# EAGLE design PCB_Team12 (EAGLE 7.5.0)
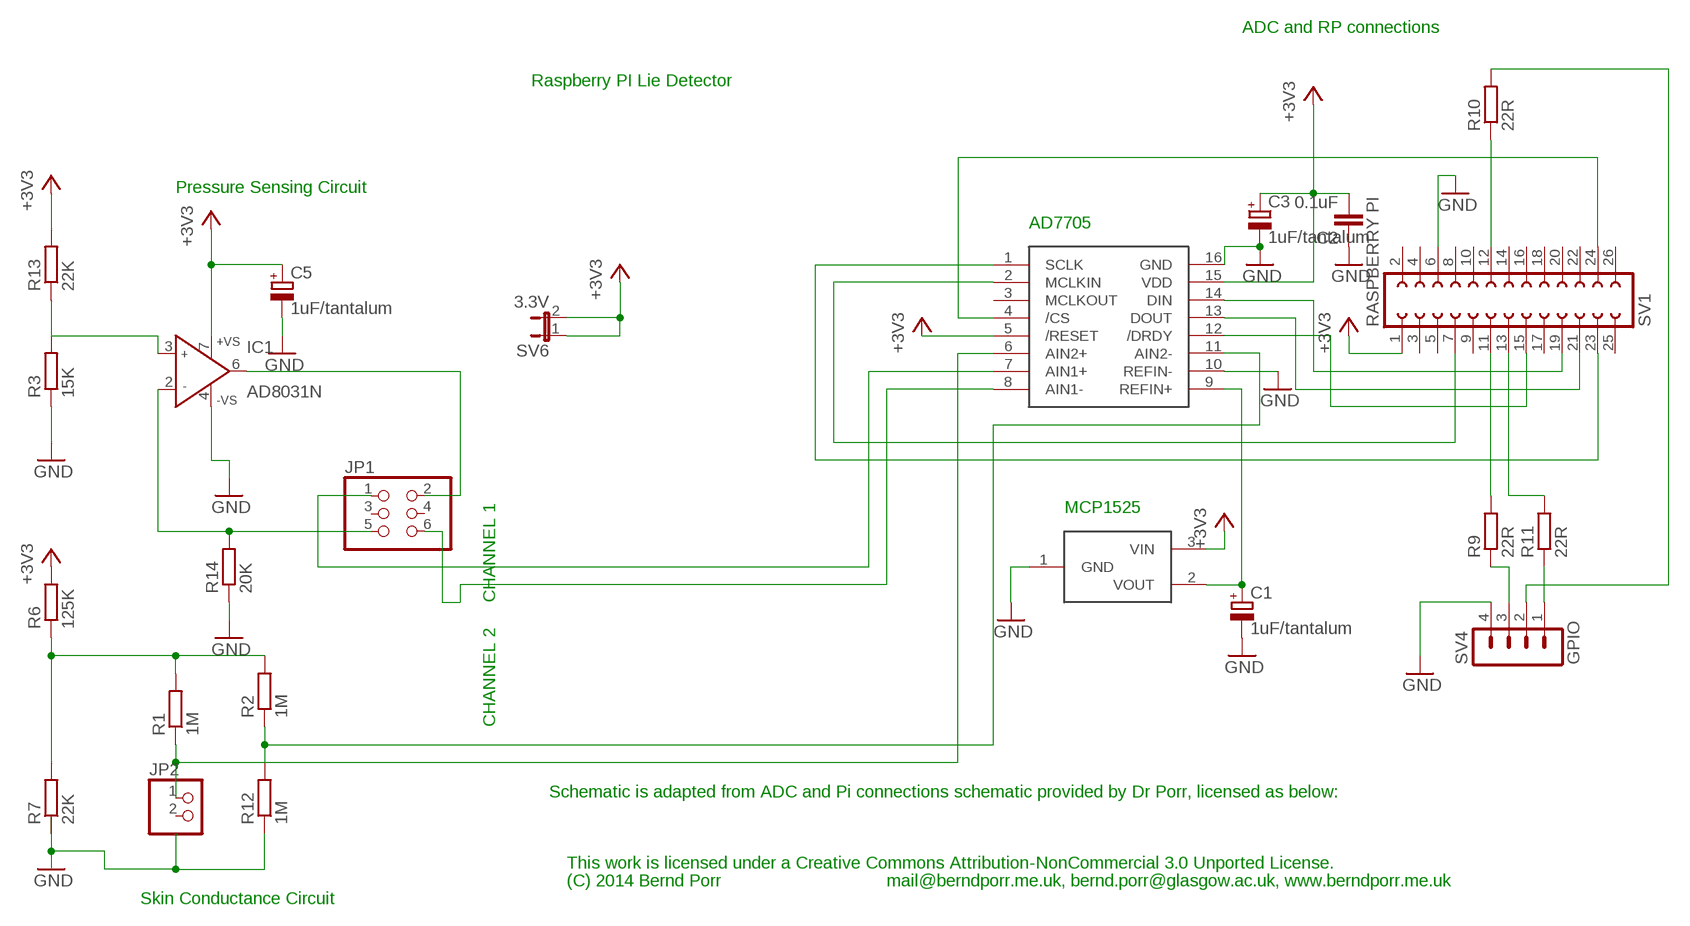
[diagram p0: schematic, sheet 1]

## Parts
C1  1uF/tantalum  CPOL-EUTT2D7  [TT2D7]
C2  0.1uF  C5/2.5  [C5B2.5]
C3  1uF/tantalum  CPOL-EUTT2D7  [TT2D7]
C5  1uF/tantalum  CPOL-EUTT2D7  [TT2D7]
IC1  AD8031N  [DIL08]
JP1  PINHD-2X3  [2X03]
JP2  PINHD-1X2  [1X02]
R1  1M  R-EU_0207/10  [0207/10]
R2  1M  R-EU_0207/10  [0207/10]
R3  15K  R-EU_0207/10  [0207/10]
R6  125K  R-EU_0207/10  [0207/10]
R7  22K  R-EU_0207/10  [0207/10]
R9  22R  R-EU_0207/10  [0207/10]
R10  22R  R-EU_0207/10  [0207/10]
R11  22R  R-EU_0207/10  [0207/10]
R12  1M  R-EU_0207/10  [0207/10]
R13  22K  R-EU_0207/10  [0207/10]
R14  20K  R-EU_0207/10  [0207/10]
SV1  RASPBERRY PI  FE13-2  [FE13-2]
SV4  GPIO  MA04-1  [MA04-1]
SV6  3.3V  JP1E  [JP1]
U$1  AD7705  [DIP16]
U$2  MCP1525  [TO92]

## Nets
+3V3: C2.2 C3.+ C5.+ IC1.7(+VS) R6.2 R13.2 SV1.1 SV6.1 SV6.2 U$1.5(/RESET) U$1.15(VDD) U$2.3(VIN)
GND: C1.- C2.1 C3.- C5.- IC1.4(-VS) R3.1 R14.1 SV1.6 SV4.4 U$1.10(REFIN-) U$1.16(GND) U$2.1(GND)
N$1: SV1.19 U$1.14(DIN)
N$2: SV1.23 U$1.1(SCLK)
N$3: SV1.7 U$1.2(MCLKIN)
N$4: SV1.24 U$1.4(/CS)
N$5: C1.+ U$1.9(REFIN+) U$2.2(VOUT)
N$6: SV1.21 U$1.13(DOUT)
N$7: IC1.2(IN-) JP1.5 R14.2
N$8: JP1.1 U$1.7(AIN1+)
N$11: R1.2 R2.2 R6.1 R7.2
N$15: R9.2 SV1.11
N$16: R10.1 SV1.12
N$17: R11.2 SV1.13
N$18: R9.1 SV4.3
N$19: R11.1 SV4.1
N$20: R10.2 SV4.2
N$21: SV1.15 U$1.12(/DRDY)
N$23: IC1.3(IN+) R3.2 R13.1
N$24: R2.1 R12.2 U$1.11(AIN2-)
N$26: IC1.6(OUT) JP1.2
N$29: JP1.6 U$1.8(AIN1-)
N$30: JP2.1 R1.1 U$1.6(AIN2+)
N$31: R12.1
Unconnected: JP1.3 JP1.4 JP2.2 R7.1 SV1.2 SV1.3 SV1.4 SV1.5 SV1.8 SV1.9 SV1.10 SV1.14 SV1.16 SV1.17 SV1.18 SV1.20 SV1.22 SV1.25 SV1.26 U$1.3(MCLKOUT)

## Notes on the sheet
- ADC and RP connections
- Raspberry PI Lie Detector
- Pressure Sensing Circuit
- AD7705
- MCP1525
- CHANNEL 1
- CHANNEL 2
- Schematic is adapted from ADC and Pi connections schematic provided by Dr Porr, licensed as below:
- This work is licensed under a Creative Commons Attribution-NonCommercial 3.0 Unported License.
- (C) 2014 Bernd Porr | mail@berndporr.me.uk, bernd.porr@glasgow.ac.uk, www.berndporr.me.uk
- Skin Conductance Circuit

## Library data of the parts
C1 C3 C5 = rcl:CPOL-EU: POLARIZED CAPACITOR, European symbol
C2 = capacitor-wima:C: CAPACITOR naming: grid - package width
IC1 = analog-devices:AD8031: 2.7 V, 800 ?A, 80 MHz Rail-to-Rail I/O Amplifiers Source: http://www.analog.com/static/imported-files/data_sheets/AD8031_8032.pdf; MPN: AD8031BNZ; OC_FARNELL: 1438575; OC_NEWARK: 15P0920
JP1 = pinhead:PINHD-2X3: PIN HEADER
JP2 = pinhead:PINHD-1X2: PIN HEADER
R1-R3 R6 R7 R9-R14 = resistor:R-EU_: RESISTOR, European symbol
SV1 = con-lsta:FE13-2: FEMALE HEADER; OC_FARNELL: unknown; OC_NEWARK: unknown
SV4 = con-lstb:MA04-1: PIN HEADER; OC_FARNELL: unknown; OC_NEWARK: unknown
SV6 = jumper:JP1E: JUMPER
U$1 = rpi:AD7705
U$2 = rpi:MCP1525

## Board
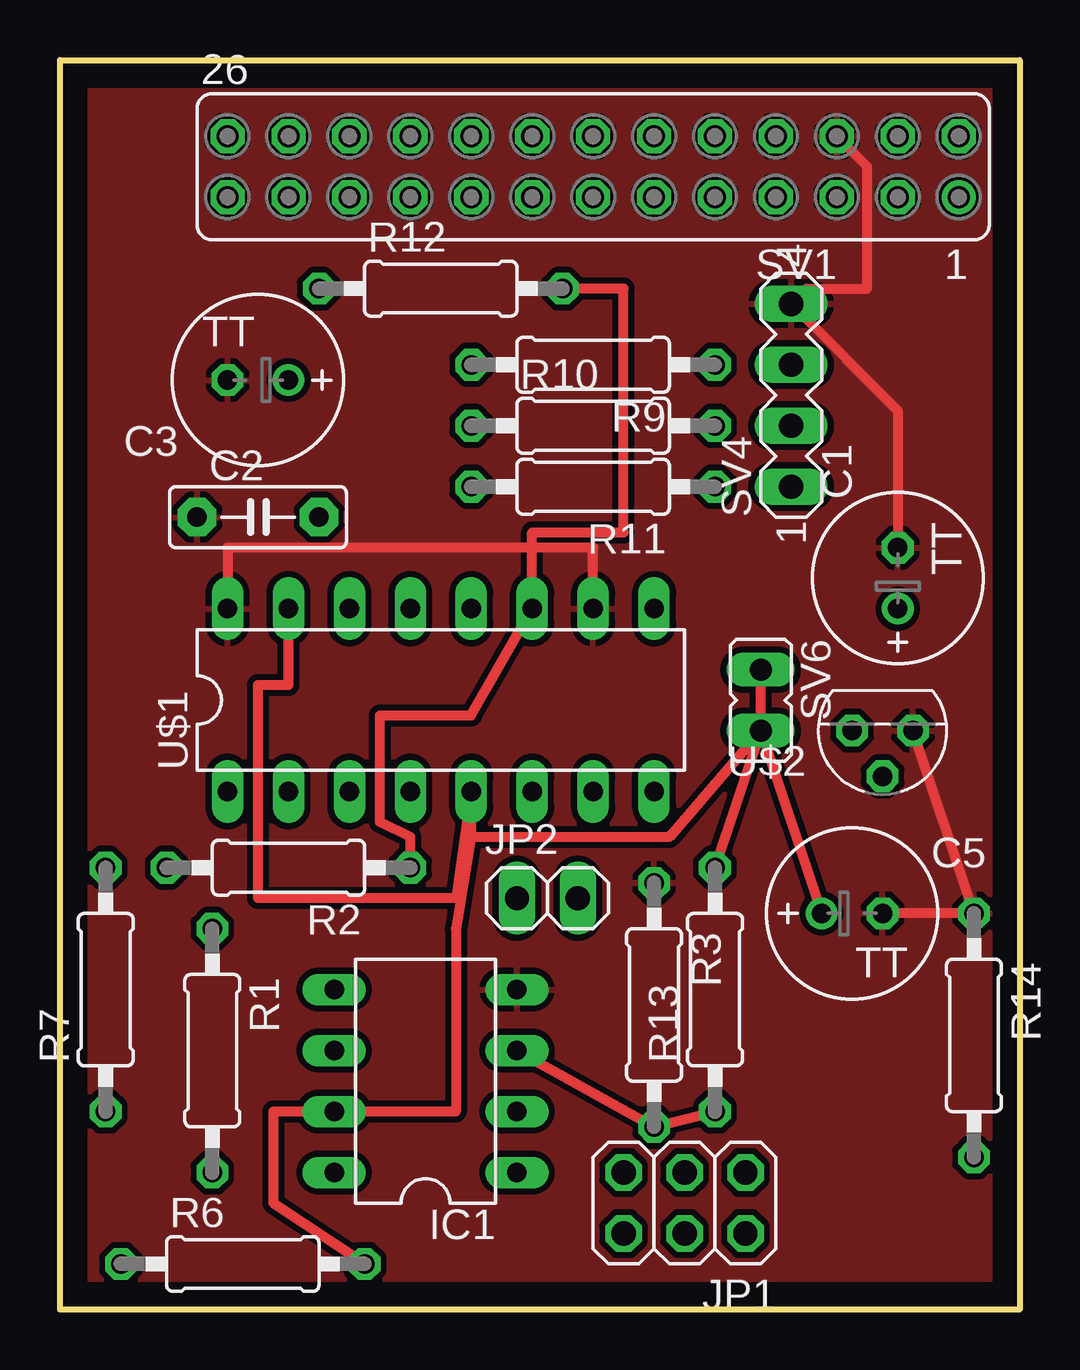
[diagram p1: board, top side]
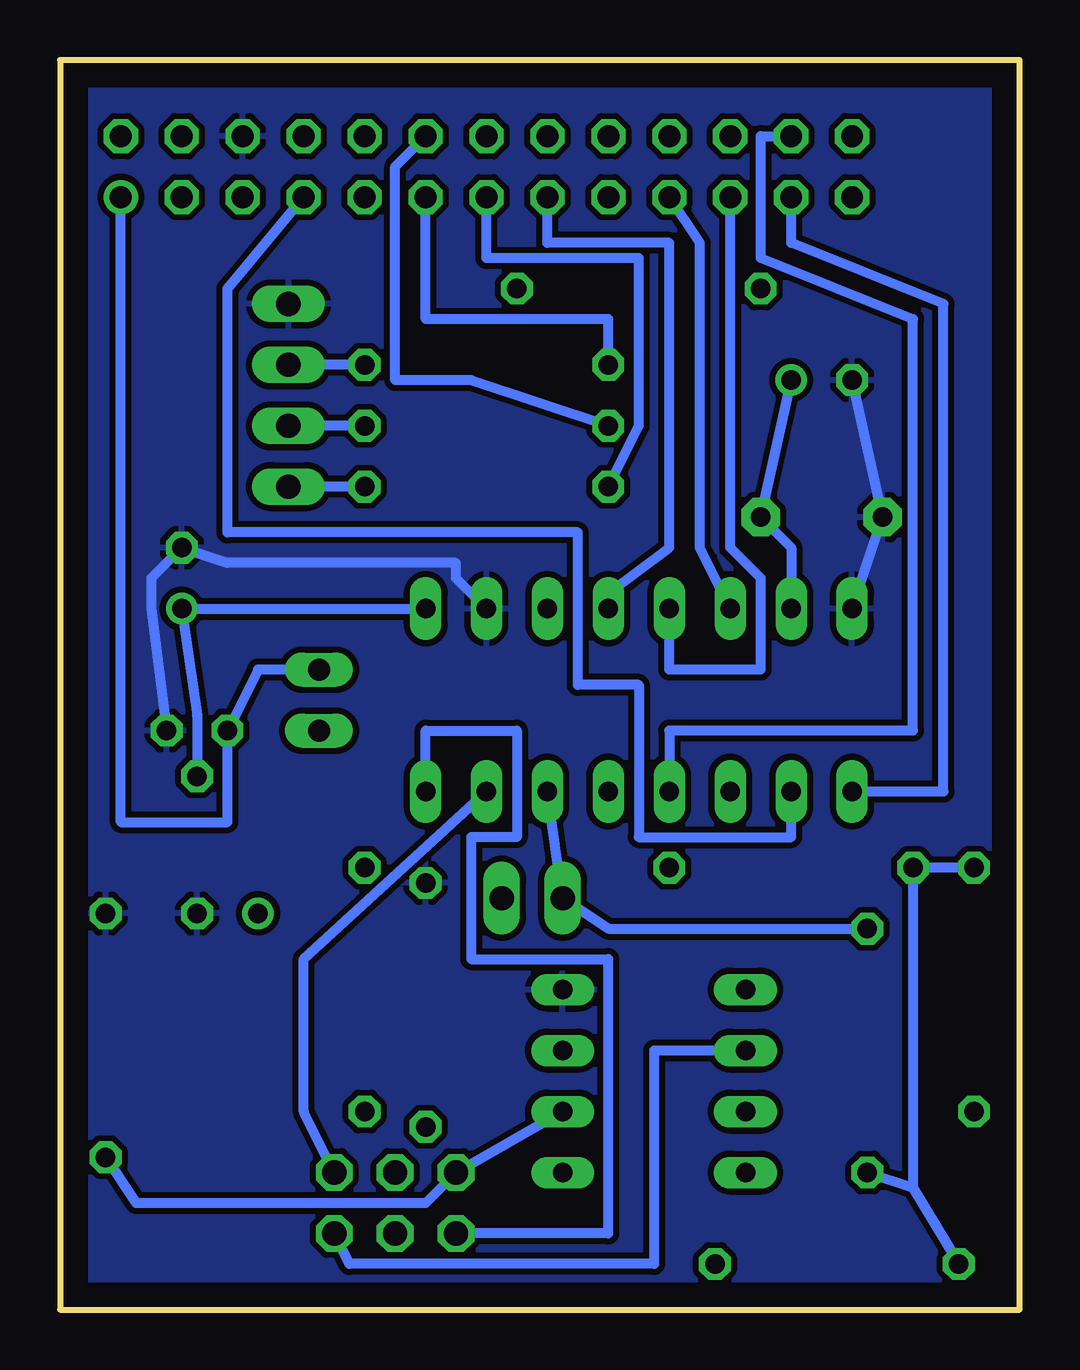
[diagram p2: board, bottom side, seen from below]

Size 40.01 x 52.07 mm. Coordinates in mm from the lower left corner, seen from the top.
Outline: 0,0 0,52.07 40.01,52.07 40.01,0 0,0
Copper layers (1*16): Top 0.035mm / dielectric 1.5mm / Bottom 0.035mm
Design rules "default": minimum track width 10mil, minimum drill 24mil, track to track 8mil, track to pad 8mil, pad to pad 8mil, via to via 8mil, smd to smd 8mil, copper to edge 40mil, drill to drill 8mil, minimum pad ring 10mil, minimum via ring 8mil, stop-mask expansion 4mil, vias tented up to drill 0mil, thermal gap 10mil

### Footprints (pad centres in the part's own frame; a part is rotated, then mirrored left to right if it is on the bottom)
TT2D7 = drill 0.813: + -1.27,0 | drill 0.813 octagon: - 1.27,0
C5B2.5 = drill 0.813 pad 1.6 octagon: 1 -2.54,0; 2 2.54,0
DIL08 = drill 0.813 long: 1 -3.81,-3.81; 2 -1.27,-3.81; 3 1.27,-3.81; 4 3.81,-3.81; 5 3.81,3.81; 6 1.27,3.81; 7 -1.27,3.81; 8 -3.81,3.81
2X03 = drill 1.016 octagon: 1 -2.54,-1.27; 2 -2.54,1.27; 3 0,-1.27; 4 0,1.27; 5 2.54,-1.27; 6 2.54,1.27
1X02 = drill 1.016 long: 1 -1.27,0; 2 1.27,0
0207/10 = drill 0.813 octagon: 1 -5.08,0; 2 5.08,0
FE13-2 = drill 0.914: 1 -15.24,1.27 | drill 0.914 octagon: 2 -15.24,-1.27; 3 -12.7,1.27; 4 -12.7,-1.27; 5 -10.16,1.27; 6 -10.16,-1.27; 7 -7.62,1.27; 8 -7.62,-1.27; 9 -5.08,1.27; 10 -5.08,-1.27; 11 -2.54,1.27; 12 -2.54,-1.27; 13 0,1.27; 14 0,-1.27; 15 2.54,1.27; 16 2.54,-1.27; 17 5.08,1.27; 18 5.08,-1.27; 19 7.62,1.27; 20 7.62,-1.27; 21 10.16,1.27; 22 10.16,-1.27; 23 12.7,1.27; 24 12.7,-1.27; 25 15.24,1.27; 26 15.24,-1.27
MA04-1 = drill 1.016 long: 1 -3.81,0; 2 -1.27,0; 3 1.27,0; 4 3.81,0
JP1 = drill 0.914 long: 1 0,-1.27; 2 0,1.27
DIP16 = drill 0.813 long: 1 -8.89,-3.81; 2 -6.35,-3.81; 3 -3.81,-3.81; 4 -1.27,-3.81; 5 1.27,-3.81; 6 3.81,-3.81; 7 6.35,-3.81; 8 8.89,-3.81; 9 8.89,3.81; 10 6.35,3.81; 11 3.81,3.81; 12 1.27,3.81; 13 -1.27,3.81; 14 -3.81,3.81; 15 -6.35,3.81; 16 -8.89,3.81
TO92 = drill 0.813 octagon: 1 -3.81,0; 2 -2.54,1.905; 3 -1.27,0

### Placement (x,y rotation side)
C1  34.92,30.48 90 top
C2  8.26,33.02 0 top
C3  8.26,38.73 180 top
C5  33.02,16.51 0 top
IC1  15.24,9.53 90 top
JP1  26.04,4.45 180 top
JP2  20.32,17.14 0 top
R1  6.35,10.79 270 top
R2  9.53,18.41 180 top
R3  24.77,12.7 270 top
R6  7.62,1.91 0 top
R7  1.91,13.34 90 top
R9  22.23,39.37 180 top
R10  22.23,36.83 0 top
R11  22.23,34.29 180 top
R12  15.88,42.55 0 top
R13  27.3,13.34 90 top
R14  38.1,11.43 270 top
SV1  22.23,47.62 180 top
SV4  30.48,38.1 90 top
SV6  29.21,25.4 180 top
U$1  15.88,25.4 0 top
U$2  31.75,24.13 180 top

### Tracks (layer width: path | path; a pad name or v marks a point on that pad's centre or on a via)
+3V3
  Top 0.406: 17.14,19.68 U$1.5 16.51,17.14 8.26,17.14 8.26,26.04 9.53,26.04 U$1.15 | R13.2 SV6.2 | SV6.2 SV6.1 | SV6.2 C5.+ | SV6.2 25.4,19.68 17.14,19.68 | 17.14,19.68 16.51,15.88 16.51,8.26 IC1.7 8.89,8.26 8.89,4.45 R6.2
  Bottom 0.406: SV1.1 37.47,20.32 33.02,20.32 U$2.3 31.75,26.67 SV6.1 | C3.+ C2.2 9.53,31.75 U$1.15
GND
  Top 0.406: U$2.1 R14.1 C5.- | U$1.10 22.23,31.75 6.99,31.75 U$1.16 | C1.- 34.92,37.47 SV4.4 31.11,42.55 33.66,42.55 33.66,47.62 SV1.6
  Bottom 0.406: U$1.10 23.5,30.48 23.5,31.11 33.02,31.11 C1.- 36.2,30.48 36.2,29.21 U$2.1 | C3.- C2.1 U$1.16
  pour Top (isolate 0.254): 0,52.07 40.01,52.07 40.01,51.44 40.01,0 0,0
  pour Bottom (isolate 0.254): 0,52.07 40.01,52.07 40.01,0 0.64,0 0,0
N$1
  Bottom 0.406: U$1.14 13.34,31.75 13.34,44.45 SV1.19
N$2
  Bottom 0.406: U$1.1 3.17,21.59 3.17,41.91 9.53,44.45 SV1.23
N$3
  Bottom 0.406: SV1.7 33.02,42.55 33.02,32.38 18.41,32.38 18.41,26.04 15.88,26.04 15.88,19.68 9.53,19.68 U$1.2
N$4
  Bottom 0.406: SV1.24 10.79,48.9 10.79,43.81 4.45,41.27 4.45,24.13 14.61,24.13 U$1.4
N$5
  Bottom 0.406: U$1.9 C1.+ 34.29,24.77 U$2.2
N$6
  Bottom 0.406: U$1.13 14.61,26.67 10.79,26.67 10.79,30.48 12.06,31.75 SV1.21
N$7
  Bottom 0.406: IC1.2 JP1.5 24.77,4.45 36.83,4.45 R14.2
N$8
  Bottom 0.406: JP1.1 29.84,8.26 29.84,14.61 U$1.7
N$11
  Bottom 0.406: 4.45,5.08 R1.2 | 4.45,5.08 R6.1 | R7.2 R2.2 4.45,5.08
N$15
  Bottom 0.406: SV1.11 24.77,41.27 17.14,41.27 R9.2
N$16
  Bottom 0.406: SV1.12 26.04,47.62 26.04,38.73 22.86,38.73 R10.1
N$17
  Bottom 0.406: SV1.13 22.23,43.81 15.88,43.81 15.88,36.83 R11.2
N$18
  Bottom 0.406: R9.1 SV4.3
N$19
  Bottom 0.406: R11.1 SV4.1
N$20
  Bottom 0.406: R10.2 SV4.2
N$21
  Bottom 0.406: U$1.12 17.14,29.84 14.61,31.75 14.61,44.45 19.68,44.45 SV1.15
N$23
  Top 0.406: IC1.3 R3.2 R13.1
N$24
  Top 0.406: R12.2 23.5,42.55 23.5,32.38 19.68,32.38 U$1.11 17.14,24.77 13.34,24.77 13.34,20.32 14.61,19.68 R2.1
N$26
  Bottom 0.406: IC1.6 15.24,10.79 15.24,1.91 27.94,1.91 JP1.2
N$29
  Bottom 0.406: U$1.8 24.77,24.13 20.95,24.13 20.95,19.68 22.86,19.68 22.86,14.61 17.14,14.61 17.14,3.17 JP1.6
N$30
  Bottom 0.406: U$1.6 JP2.1 17.14,15.88 R1.1